# EAGLE design gamifyPCB (EAGLE 9.4.1)
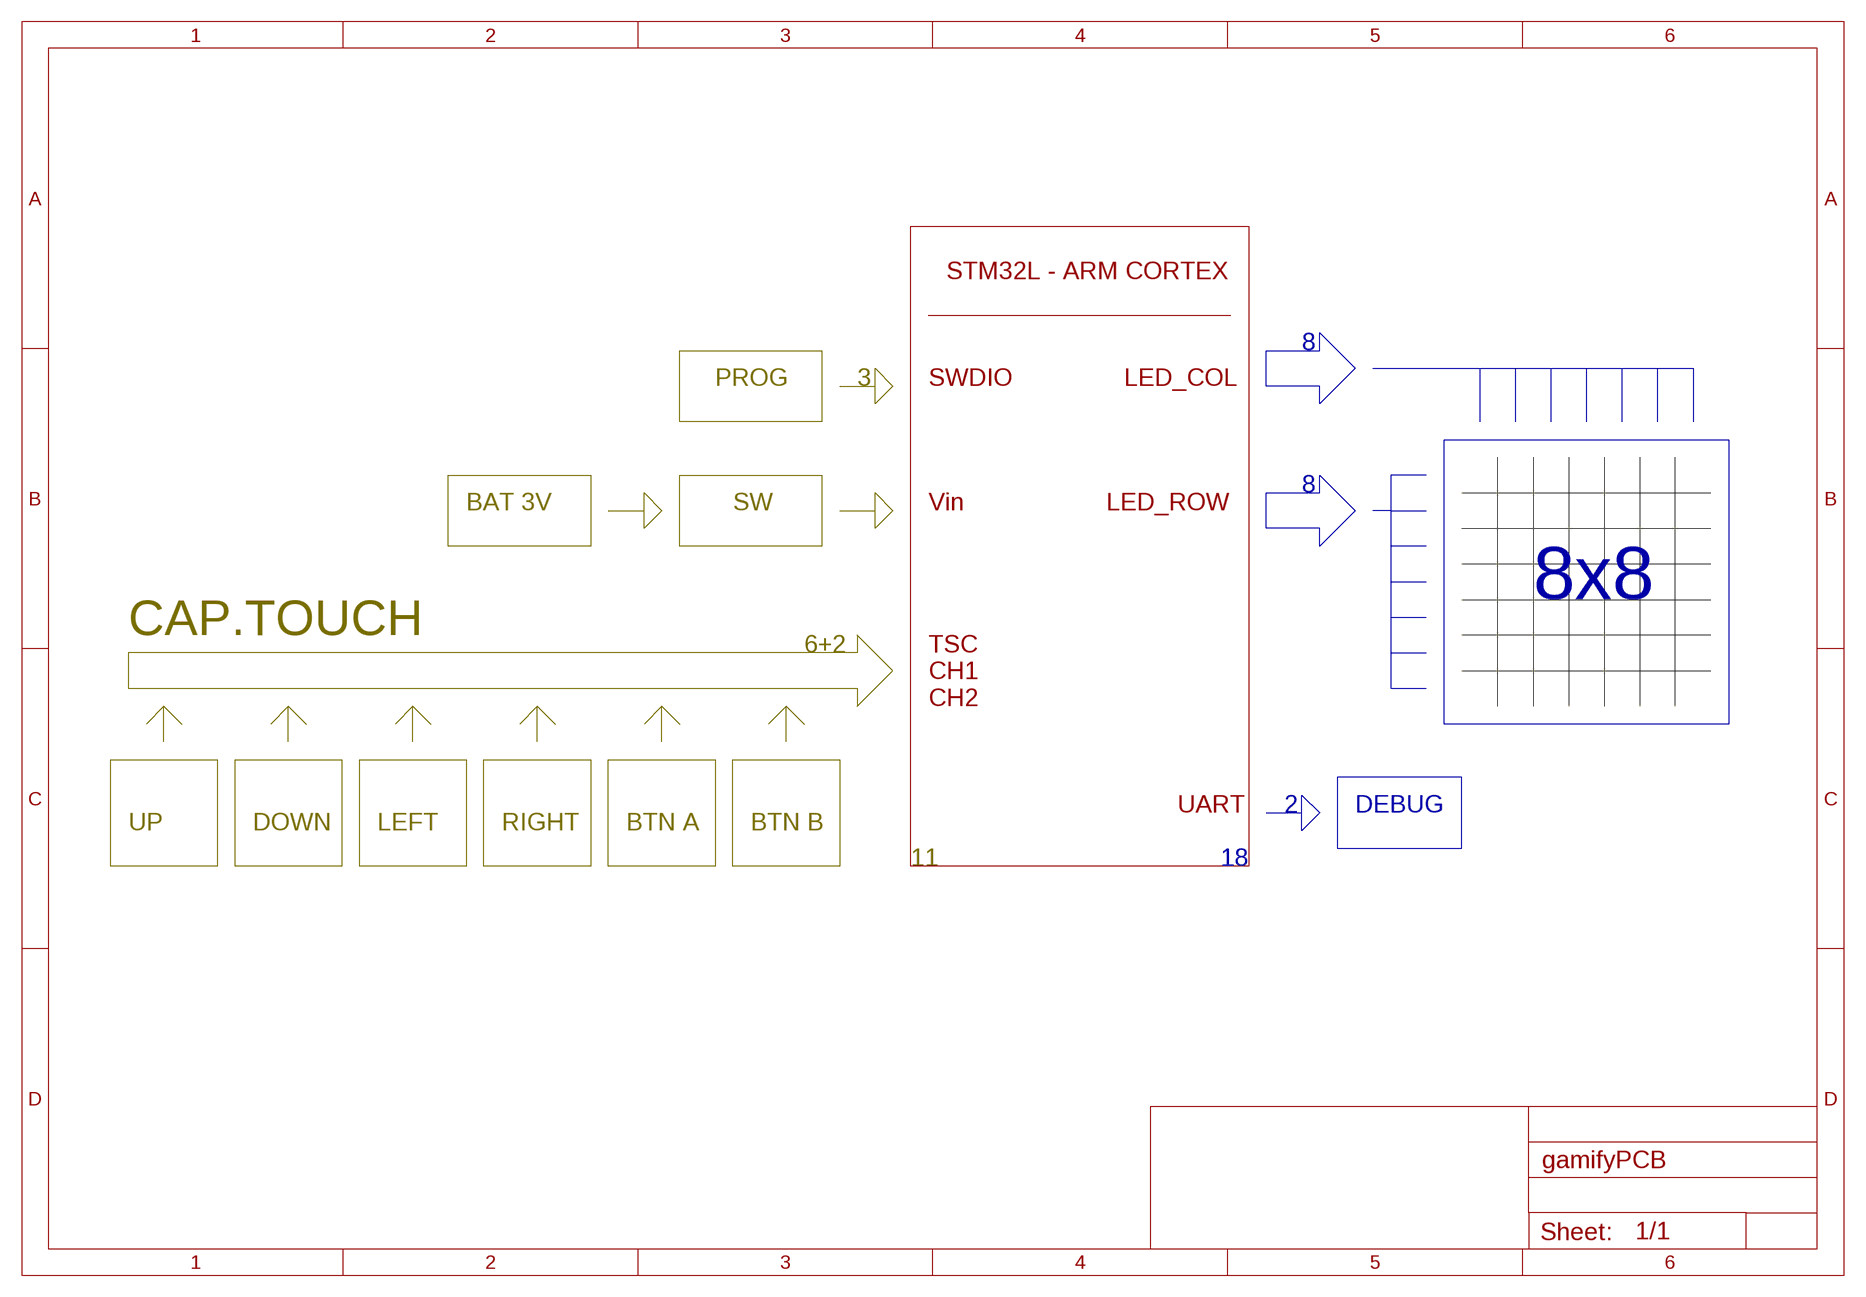
[diagram p0: schematic, sheet 1, part 1 of 2]
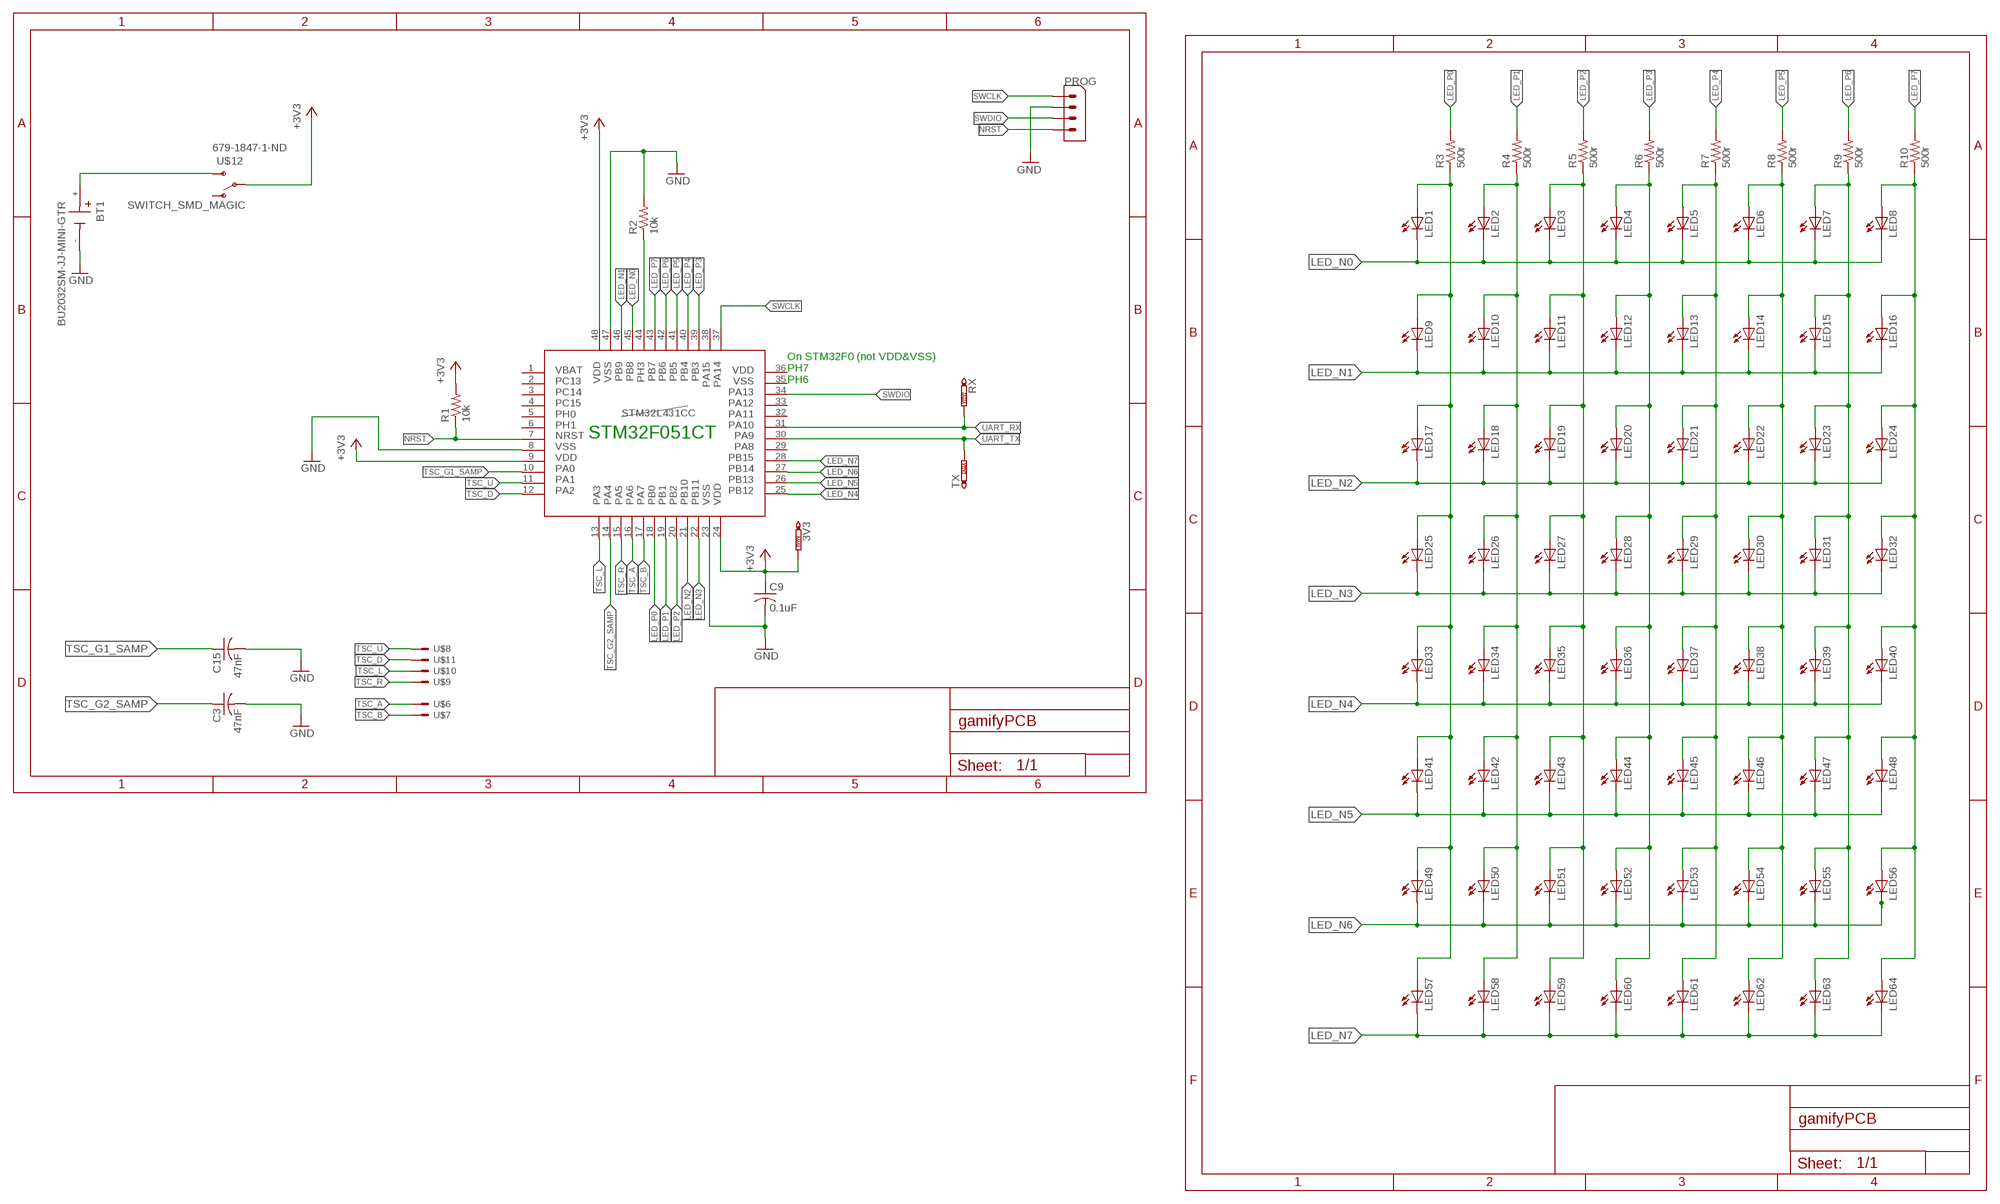
[diagram p1: schematic, sheet 1, part 2 of 2]

## Parts
3V3  PTR1B1,27  [B1,27]
BT1  BU2032SM-JJ-MINI-GTR  [BAT_BU2032SM-JJ-MINI-GTR]
C3  47nF  C-USC0603  [C0603]
C9  0.1uF  C-USC0603  [C0603]
C15  47nF  C-USC0603  [C0603]
LED1  LEDCHIP-LED0603  [CHIP-LED0603]
LED2  LEDCHIP-LED0603  [CHIP-LED0603]
LED3  LEDCHIP-LED0603  [CHIP-LED0603]
LED4  LEDCHIP-LED0603  [CHIP-LED0603]
LED5  LEDCHIP-LED0603  [CHIP-LED0603]
LED6  LEDCHIP-LED0603  [CHIP-LED0603]
LED7  LEDCHIP-LED0603  [CHIP-LED0603]
LED8  LEDCHIP-LED0603  [CHIP-LED0603]
LED9  LEDCHIP-LED0603  [CHIP-LED0603]
LED10  LEDCHIP-LED0603  [CHIP-LED0603]
LED11  LEDCHIP-LED0603  [CHIP-LED0603]
LED12  LEDCHIP-LED0603  [CHIP-LED0603]
LED13  LEDCHIP-LED0603  [CHIP-LED0603]
LED14  LEDCHIP-LED0603  [CHIP-LED0603]
LED15  LEDCHIP-LED0603  [CHIP-LED0603]
LED16  LEDCHIP-LED0603  [CHIP-LED0603]
LED17  LEDCHIP-LED0603  [CHIP-LED0603]
LED18  LEDCHIP-LED0603  [CHIP-LED0603]
LED19  LEDCHIP-LED0603  [CHIP-LED0603]
LED20  LEDCHIP-LED0603  [CHIP-LED0603]
LED21  LEDCHIP-LED0603  [CHIP-LED0603]
LED22  LEDCHIP-LED0603  [CHIP-LED0603]
LED23  LEDCHIP-LED0603  [CHIP-LED0603]
LED24  LEDCHIP-LED0603  [CHIP-LED0603]
LED25  LEDCHIP-LED0603  [CHIP-LED0603]
LED26  LEDCHIP-LED0603  [CHIP-LED0603]
LED27  LEDCHIP-LED0603  [CHIP-LED0603]
LED28  LEDCHIP-LED0603  [CHIP-LED0603]
LED29  LEDCHIP-LED0603  [CHIP-LED0603]
LED30  LEDCHIP-LED0603  [CHIP-LED0603]
LED31  LEDCHIP-LED0603  [CHIP-LED0603]
LED32  LEDCHIP-LED0603  [CHIP-LED0603]
LED33  LEDCHIP-LED0603  [CHIP-LED0603]
LED34  LEDCHIP-LED0603  [CHIP-LED0603]
LED35  LEDCHIP-LED0603  [CHIP-LED0603]
LED36  LEDCHIP-LED0603  [CHIP-LED0603]
LED37  LEDCHIP-LED0603  [CHIP-LED0603]
LED38  LEDCHIP-LED0603  [CHIP-LED0603]
LED39  LEDCHIP-LED0603  [CHIP-LED0603]
LED40  LEDCHIP-LED0603  [CHIP-LED0603]
LED41  LEDCHIP-LED0603  [CHIP-LED0603]
LED42  LEDCHIP-LED0603  [CHIP-LED0603]
LED43  LEDCHIP-LED0603  [CHIP-LED0603]
LED44  LEDCHIP-LED0603  [CHIP-LED0603]
LED45  LEDCHIP-LED0603  [CHIP-LED0603]
LED46  LEDCHIP-LED0603  [CHIP-LED0603]
LED47  LEDCHIP-LED0603  [CHIP-LED0603]
LED48  LEDCHIP-LED0603  [CHIP-LED0603]
LED49  LEDCHIP-LED0603  [CHIP-LED0603]
LED50  LEDCHIP-LED0603  [CHIP-LED0603]
LED51  LEDCHIP-LED0603  [CHIP-LED0603]
LED52  LEDCHIP-LED0603  [CHIP-LED0603]
LED53  LEDCHIP-LED0603  [CHIP-LED0603]
LED54  LEDCHIP-LED0603  [CHIP-LED0603]
LED55  LEDCHIP-LED0603  [CHIP-LED0603]
LED56  LEDCHIP-LED0603  [CHIP-LED0603]
LED57  LEDCHIP-LED0603  [CHIP-LED0603]
LED58  LEDCHIP-LED0603  [CHIP-LED0603]
LED59  LEDCHIP-LED0603  [CHIP-LED0603]
LED60  LEDCHIP-LED0603  [CHIP-LED0603]
LED61  LEDCHIP-LED0603  [CHIP-LED0603]
LED62  LEDCHIP-LED0603  [CHIP-LED0603]
LED63  LEDCHIP-LED0603  [CHIP-LED0603]
LED64  LEDCHIP-LED0603  [CHIP-LED0603]
PROG  4-PIN-1.25MM  [4-PIN-1.25MM]
R1  10k  R-US_R0603  [R0603]
R2  10k  R-US_R0603  [R0603]
R3  500r  R-US_R0603  [R0603]
R4  500r  R-US_R0603  [R0603]
R5  500r  R-US_R0603  [R0603]
R6  500r  R-US_R0603  [R0603]
R7  500r  R-US_R0603  [R0603]
R8  500r  R-US_R0603  [R0603]
R9  500r  R-US_R0603  [R0603]
R10  500r  R-US_R0603  [R0603]
RX  PTR1B1,27  [B1,27]
TX  PTR1B1,27  [B1,27]
U$2  STM32L431CC  [QFP50P900X900X160-48]
U$6  CAP_BUTTON  [CAPBUTTON]
U$7  CAP_BUTTON  [CAPBUTTON]
U$8  CAP_DPAD  [DPAD]
U$9  CAP_DPAD  [DPAD]
U$10  CAP_DPAD  [DPAD]
U$11  CAP_DPAD  [DPAD]
U$12  SWITCH_SMD_MAGIC  [SWITCH_SMD_SUNKEN]

## Nets
+3V3: 3V3.TP C9.1 R1.2 U$2.9 U$2.24 U$2.48 U$12.2(P)
GND: BT1.- C3.2 C9.2 C15.2 PROG.P$3 R2.2 U$2.8 U$2.23 U$2.47
LED_N0: LED1.C LED2.C LED3.C LED4.C LED5.C LED6.C LED7.C LED8.C U$2.45
LED_N1: LED9.C LED10.C LED11.C LED12.C LED13.C LED14.C LED15.C LED16.C U$2.46
LED_N2: LED17.C LED18.C LED19.C LED20.C LED21.C LED22.C LED23.C LED24.C U$2.21
LED_N3: LED25.C LED26.C LED27.C LED28.C LED29.C LED30.C LED31.C LED32.C U$2.22
LED_N4: LED33.C LED34.C LED35.C LED36.C LED37.C LED38.C LED39.C LED40.C U$2.25
LED_N5: LED41.C LED42.C LED43.C LED44.C LED45.C LED46.C LED47.C LED48.C U$2.26
LED_N6: LED49.C LED50.C LED51.C LED52.C LED53.C LED54.C LED55.C LED56.C U$2.27
LED_N7: LED57.C LED58.C LED59.C LED60.C LED61.C LED62.C LED63.C LED64.C U$2.28
LED_P0: R3.2 U$2.18
LED_P0B: LED1.A LED9.A LED17.A LED25.A LED33.A LED41.A LED49.A LED57.A R3.1
LED_P1: R4.2 U$2.19
LED_P1B: LED2.A LED10.A LED18.A LED26.A LED34.A LED42.A LED50.A LED58.A R4.1
LED_P2: R5.2 U$2.20
LED_P2B: LED3.A LED11.A LED19.A LED27.A LED35.A LED43.A LED51.A LED59.A R5.1
LED_P3: R6.2 U$2.39
LED_P3B: LED4.A LED12.A LED20.A LED28.A LED36.A LED44.A LED52.A LED60.A R6.1
LED_P4: R7.2 U$2.40
LED_P4B: LED5.A LED13.A LED21.A LED29.A LED37.A LED45.A LED53.A LED61.A R7.1
LED_P5: R8.2 U$2.41
LED_P5B: LED6.A LED14.A LED22.A LED30.A LED38.A LED46.A LED54.A LED62.A R8.1
LED_P6: R9.2 U$2.42
LED_P6B: LED7.A LED15.A LED23.A LED31.A LED39.A LED47.A LED55.A LED63.A R9.1
LED_P7: R10.2 U$2.43
LED_P7B: LED8.A LED16.A LED24.A LED32.A LED40.A LED48.A LED56.A LED64.A R10.1
N$6: R2.1 U$2.44
N$14: BT1.+ U$12.3(S)
NRST: PROG.P$1 R1.1 U$2.7
SWCLK: PROG.P$4 U$2.37
SWDIO: PROG.P$2 U$2.34
TSC_A: U$2.16 U$6.P$1(S) U$6.P$2(S)
TSC_B: U$2.17 U$7.P$1(S) U$7.P$2(S)
TSC_D: U$2.12 U$11.P$1(S)
TSC_G1_SAMP: C15.1 U$2.10
TSC_G2_SAMP: C3.1 U$2.14
TSC_L: U$2.13 U$10.P$1(S)
TSC_R: U$2.15 U$9.P$1(S)
TSC_U: U$2.11 U$8.P$1(S)
UART_RX: RX.TP U$2.31
UART_TX: TX.TP U$2.30
Unconnected: U$2.1 U$2.2 U$2.3 U$2.4 U$2.5 U$2.6 U$2.29 U$2.32 U$2.33 U$2.35 U$2.36 U$2.38 U$12.1(O)

## Buses
B$1
B$2
B$3
B$4
B$5
B$7
B$6
B$8

## Notes on the sheet
- 679-1847-1-ND
- STM32L - ARM CORTEX
- 8
- PROG | 3 | SWDIO | LED_COL
- 8
- BAT 3V | SW | Vin | LED_ROW
- 8x8
- On STM32F0 (not VDD&VSS)
  PH7
  PH6
- CAP.TOUCH
- 6+2
- TSC 
  CH1
  CH2
- STM32F051CT
- UART | 2 | DEBUG
- UP | DOWN | LEFT | RIGHT | BTN A | BTN B
- 11 | 18

## Library data of the parts
3V3 RX TX = testpad:PTR1: TEST PIN
BT1 = BU2032SM-JJ-MINI-GTR:BU2032SM-JJ-MINI-GTR; AVAILABILITY: Unavailable; DESCRIPTION: Battery Holder _Open_ Coin, 20.0mm 1 Cell SMD _SMT_ Tab; MF: MPD _Memory; MP: BU2032SM-JJ-MINI-GTR; PACKAGE: None; PRICE: None
C3 C9 C15 = rcl:C-US: CAPACITOR, American symbol; SPICEPREFIX: C
LED1-LED64 = adafruit:LED: LED OSRAM: - CHIPLED LG R971, LG N971, LY N971, LG Q971, LY Q971, LO R971, LY R971 LH N974, LH R974 LS Q976, LO Q976, LY Q976 LO Q996 - Hyper CHIPLED LW Q18S LB Q993, LB Q99A, LB R99A - SideLED LS A670, LO A670, LY A670, LG A670, LP A670 LB A673, LV A673, LT A673, LW A673 LH A674 LY A675 LS A676, LA A676, LO A676, LY A676, LW A676 LS A679, LY A679, LG A679 - Hyper Micro SIDELED® LS Y876, LA Y876, LO Y876, LY Y876 LT Y87S - SmartLED LW L88C, LW L88S LB L89C, LB L89S, LG L890 LS L89K, LO L89K, LY L89K LS L896, LA L896, LO L896, LY L896 - TOPLED LS T670, LO T670, LY T670, LG T670, LP T670 LSG T670, LSP T670, LSY T670, LOP T670, LYG T670 LG T671, LOG T671, LSG T671 LB T673, LV T673, LT T673, LW T673 LH T674 LS T676, LA T676, LO T676, LY T676, LB T676, LH T676, LSB T676, LW T676 LB T67C, LV T67C, LT T67C, LS T67K, LO T67K, LY T67K, LW E67C LS E67B, LA E67B, LO E67B, LY E67B, LB E67C, LV E67C, LT E67C LW T67C LS T679, LY T679, LG T679 LS T770, LO T770, LY T770, LG T770, LP T770 LB T773, LV T773, LT T773, LW T773 LH T774 LS E675, LA E675, LY E675, LS T675 LS T776, LA T776, LO T776, LY T776, LB T776 LHGB T686 LT T68C, LB T68C - Hyper Mini TOPLED® LB M676 - Mini TOPLED Santana® LG M470 LS M47K, LO M47K, LY M47K Source: http://www.osram.convergy.de/
PROG = Wingling Library:4-PIN-1.25MM
R1-R10 = rcl:R-US_: RESISTOR, American symbol; SPICEPREFIX: R
U$2 = prankbox:STM32L431CC
U$6 U$7 = !klib:CAP_BUTTON
U$8-U$11 = !klib:CAP_DPAD
U$12 = !klib:SWITCH_SMD_MAGIC

## Board
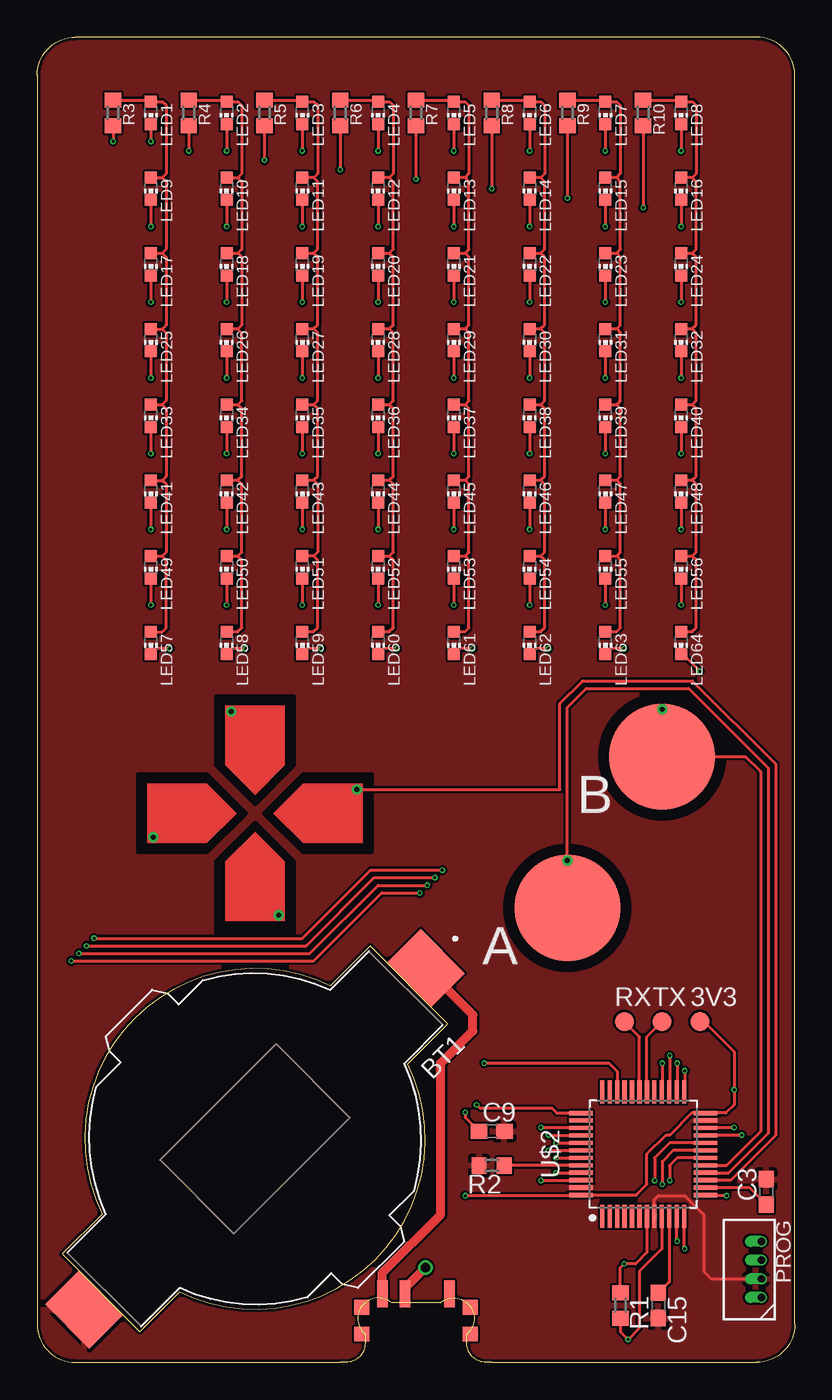
[diagram p2: board, top side]
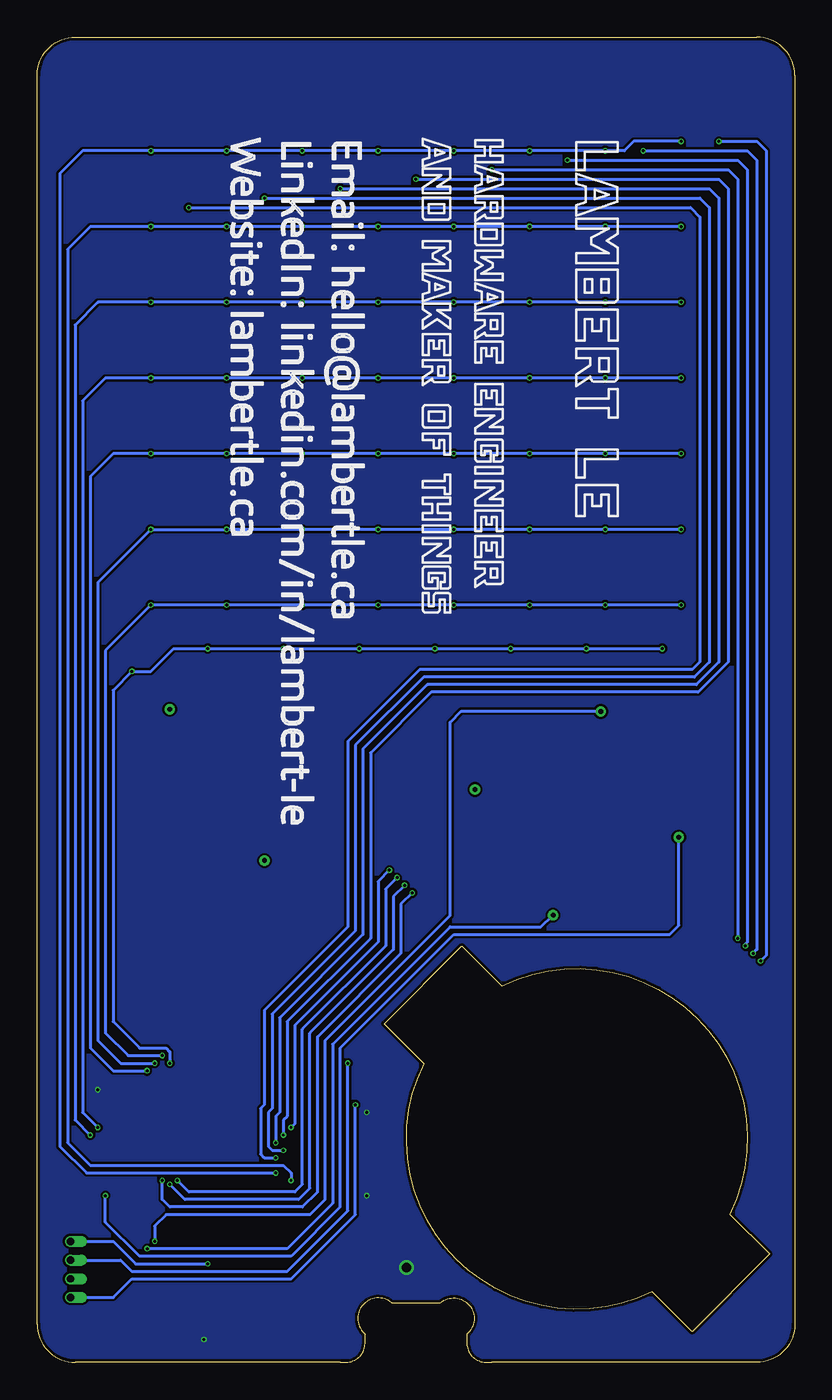
[diagram p3: board, bottom side, seen from below]

Size 50.8 x 88.9 mm. Coordinates in mm from the lower left corner, seen from the top.
Outline: 20.32,0 2.54,0 arc-90 0,2.54 0,86.36 arc-90 2.54,88.9 48.26,88.9 arc-90 50.8,86.36 50.8,2.54 arc-90 48.26,0 30.48,0
Copper layers (1*16): Top 0.035mm / dielectric 0.2mm / Bottom 0.035mm
Design rules "JLC_2Layer_(workInProgress)": minimum track width 3.5mil, minimum drill 0.2mm, track to track 3.5mil, track to pad 5mil, pad to pad 5mil, via to via 5mil, smd to smd 0mil, copper to edge 0.2mm, drill to drill 0.2mm, minimum pad ring 3mil, minimum via ring 3mil, stop-mask expansion 0mil, vias tented up to drill 100mil, thermal gap 10mil

### Footprints (pad centres in the part's own frame; a part is rotated, then mirrored left to right if it is on the bottom)
B1,27 = smd 1.27 x 1.27: TP 0,0
BAT_BU2032SM-JJ-MINI-GTR = smd 3.2 x 4.2: + -16.205,0; - 16.205,0
C0603 = smd 1.1 x 1: 1 -0.85,0; 2 0.85,0
CHIP-LED0603 = smd 0.8 x 0.8: A 0,-0.75; C 0,0.75
4-PIN-1.25MM = drill 0.5 offset: P$1 -1.875,0.82; P$2 -0.625,0.82; P$3 0.625,0.82; P$4 1.875,0.82
R0603 = smd 1 x 1.1: 1 -0.85,0; 2 0.85,0
QFP50P900X900X160-48 = smd 1.559 x 0.28: 1 -4.178,2.75; 2 -4.178,2.25; 3 -4.178,1.75; 4 -4.178,1.25; 5 -4.178,0.75; 6 -4.178,0.25; 7 -4.178,-0.25; 8 -4.178,-0.75; 9 -4.178,-1.25; 10 -4.178,-1.75; 11 -4.178,-2.25; 12 -4.178,-2.75; 25 4.178,-2.75; 26 4.178,-2.25; 27 4.178,-1.75; 28 4.178,-1.25; 29 4.178,-0.75; 30 4.178,-0.25; 31 4.178,0.25; 32 4.178,0.75; 33 4.178,1.25; 34 4.178,1.75; 35 4.178,2.25; 36 4.178,2.75 | smd 0.28 x 1.559: 13 -2.75,-4.178; 14 -2.25,-4.178; 15 -1.75,-4.178; 16 -1.25,-4.178; 17 -0.75,-4.178; 18 -0.25,-4.178; 19 0.25,-4.178; 20 0.75,-4.178; 21 1.25,-4.178; 22 1.75,-4.178; 23 2.25,-4.178; 24 2.75,-4.178; 37 2.75,4.178; 38 2.25,4.178; 39 1.75,4.178; 40 1.25,4.178; 41 0.75,4.178; 42 0.25,4.178; 43 -0.25,4.178; 44 -0.75,4.178; 45 -1.25,4.178; 46 -1.75,4.178; 47 -2.25,4.178; 48 -2.75,4.178
CAPBUTTON = smd 7.112 x 7.112: P$1 0,0 | drill 0.33 pad 0.686: P$2 0,3.175
DPAD = drill 0.33 pad 0.686: P$1 -6.2,-1.6
SWITCH_SMD_SUNKEN = smd 0.7 x 1.8: 1 -2.25,-4.592; 2 0.75,-4.592; 3 2.25,-4.592 | smd 1 x 1: GND1 -3.65,-1.892; GND2 -3.65,-3.692; GND3 3.65,-1.892; GND4 3.65,-3.692

### Placement (x,y rotation side)
3V3  44.45,22.86 0 top
BT1  14.61,14.99 225 top
C3  48.9,11.43 90 top
C9  30.48,15.49 0 top
C15  41.66,3.81 270 top
LED1  7.62,83.82 180 top
LED2  12.7,83.82 180 top
LED3  17.78,83.82 180 top
LED4  22.86,83.82 180 top
LED5  27.94,83.82 180 top
LED6  33.02,83.82 180 top
LED7  38.1,83.82 180 top
LED8  43.18,83.82 180 top
LED9  7.62,78.74 180 top
LED10  12.7,78.74 180 top
LED11  17.78,78.74 180 top
LED12  22.86,78.74 180 top
LED13  27.94,78.74 180 top
LED14  33.02,78.74 180 top
LED15  38.1,78.74 180 top
LED16  43.18,78.74 180 top
LED17  7.62,73.66 180 top
LED18  12.7,73.66 180 top
LED19  17.78,73.66 180 top
LED20  22.86,73.66 180 top
LED21  27.94,73.66 180 top
LED22  33.02,73.66 180 top
LED23  38.1,73.66 180 top
LED24  43.18,73.66 180 top
LED25  7.62,68.58 180 top
LED26  12.7,68.58 180 top
LED27  17.78,68.58 180 top
LED28  22.86,68.58 180 top
LED29  27.94,68.58 180 top
LED30  33.02,68.58 180 top
LED31  38.1,68.58 180 top
LED32  43.18,68.58 180 top
LED33  7.62,63.5 180 top
LED34  12.7,63.5 180 top
LED35  17.78,63.5 180 top
LED36  22.86,63.5 180 top
LED37  27.94,63.5 180 top
LED38  33.02,63.5 180 top
LED39  38.1,63.5 180 top
LED40  43.18,63.5 180 top
LED41  7.62,58.42 180 top
LED42  12.7,58.42 180 top
LED43  17.78,58.42 180 top
LED44  22.86,58.42 180 top
LED45  27.94,58.42 180 top
LED46  33.02,58.42 180 top
LED47  38.1,58.42 180 top
LED48  43.18,58.42 180 top
LED49  7.62,53.34 180 top
LED50  12.7,53.34 180 top
LED51  17.78,53.34 180 top
LED52  22.86,53.34 180 top
LED53  27.94,53.34 180 top
LED54  33.02,53.34 180 top
LED55  38.1,53.34 180 top
LED56  43.18,53.34 180 top
LED57  7.62,48.26 180 top
LED58  12.7,48.26 180 top
LED59  17.78,48.26 180 top
LED60  22.86,48.26 180 top
LED61  27.94,48.26 180 top
LED62  33.02,48.26 180 top
LED63  38.1,48.26 180 top
LED64  43.18,48.26 180 top
PROG  47.75,6.22 270 top
R1  39.12,3.81 270 top
R2  30.48,13.21 180 top
R3  5.08,83.82 270 top
R4  10.16,83.82 270 top
R5  15.24,83.82 270 top
R6  20.32,83.82 270 top
R7  25.4,83.82 270 top
R8  30.48,83.82 270 top
R9  35.56,83.82 270 top
R10  40.64,83.82 270 top
RX  39.37,22.86 0 top
TX  41.91,22.86 0 top
U$2  40.64,13.97 90 top
U$6  35.56,30.48 0 top
U$7  41.91,40.64 0 top
U$8  14.61,37.47 270 top
U$9  15.24,36.83 180 top
U$10  13.97,36.83 0 top
U$11  14.61,36.2 90 top
U$12  25.4,0 180 top

### Tracks (layer width: path | path; a pad name or v marks a point on that pad's centre or on a via)
+3V3  (via drill 0.2, 0.65)
  Top 0.203: C9.1 28.7,16.42 v28.7,16.76 | R1.2 39.12,2.03 v39.62,1.52 40.39,2.29 40.39,6.1 41.89,7.6 U$2.9 | v28.7,11.18 36.42,11.18 U$2.48 40.18,11.22 40.89,11.94 40.89,13.97 42.16,15.24 42.42,15.24 43.9,16.72 U$2.24 46.18,16.72 46.74,17.27 v46.74,18.29 46.74,20.83 44.7,22.86 3V3.TP
  Top 0.61: U$12.2 24.65,4.96 v26.04,6.35
  pour Bottom (isolate 0.152): -5.08,-7.62 53.34,-7.62 53.34,93.98 -5.08,93.98
GND
  Top 0.203: U$2.8 41.39,10.91 41.66,11.18 43.43,11.18 44.7,9.91 44.7,6.1 45.21,5.59 48.56,5.59 PROG.P$3
  pour Top (isolate 0.152): -2.54,91.44 55.88,91.44 55.88,-5.08 -2.54,-5.08
LED_N0  (via drill 0.2)
  Top 0.203: LED1.C v7.62,81.92 | LED2.C v12.7,81.28 | LED3.C v17.78,81.28 | LED4.C v22.86,81.28 | LED5.C v27.94,81.28 | LED6.C v33.02,81.28 | LED7.C v38.1,81.28 | LED8.C v43.18,81.28 | v34.8,12.7 34.82,12.72 U$2.45
  Bottom 0.203: v7.62,81.92 10.79,81.92 11.43,81.28 v12.7,81.28 v17.78,81.28 v22.86,81.28 v27.94,81.28 v33.02,81.28 v38.1,81.28 v43.18,81.28 47.75,81.28 49.28,79.76 49.28,14.48 47.5,12.7 v34.8,12.7
LED_N1  (via drill 0.2)
  Top 0.203: LED9.C v7.62,76.2 | LED10.C v12.7,76.2 | LED11.C v17.78,76.2 | LED12.C v22.86,76.2 | LED13.C v27.94,76.2 | LED14.C v33.02,76.2 | LED15.C v38.1,76.2 | LED16.C v43.18,76.2 | v33.78,12.19 36.43,12.19 U$2.46
  Bottom 0.203: v7.62,76.2 v12.7,76.2 v17.78,76.2 v22.86,76.2 v27.94,76.2 v33.02,76.2 v38.1,76.2 v43.18,76.2 47.24,76.2 48.77,74.68 48.77,14.73 47.24,13.21 34.29,13.21 33.78,12.7 v33.78,12.19
LED_N2  (via drill 0.2)
  Top 0.203: LED17.C v7.62,71.12 | LED18.C v12.7,71.12 | LED19.C v17.78,71.12 | LED20.C v22.86,71.12 | LED21.C v27.94,71.12 | LED22.C v33.02,71.12 | LED23.C v38.1,71.12 | LED24.C v43.18,71.12 | v47.24,15.24 47.22,15.22 U$2.21
  Bottom 0.203: v7.62,71.12 v12.7,71.12 v17.78,71.12 v22.86,71.12 v27.94,71.12 v33.02,71.12 v38.1,71.12 v43.18,71.12 46.74,71.12 48.26,69.6 48.26,16.26 v47.24,15.24
LED_N3  (via drill 0.2)
  Top 0.203: LED25.C v7.62,66.04 | LED26.C v12.7,66.04 | LED27.C v17.78,66.04 | LED28.C v22.86,66.04 | LED29.C v27.94,66.04 | LED31.C v38.1,66.04 | LED32.C v43.18,66.04 | LED30.C v33.02,66.04 | v46.74,15.75 46.71,15.72 U$2.22
  Bottom 0.203: v7.62,66.04 v12.7,66.04 v17.78,66.04 v22.86,66.04 v27.94,66.04 v33.02,66.04 v38.1,66.04 v43.18,66.04 46.23,66.04 47.75,64.52 47.75,16.76 v46.74,15.75
LED_N4  (via drill 0.2)
  Top 0.203: LED33.C v7.62,60.96 | LED34.C v12.7,60.96 | LED35.C v17.78,60.96 | LED36.C v22.86,60.96 | LED37.C v27.94,60.96 | LED38.C v33.02,60.96 | LED39.C v38.1,60.96 | LED40.C v43.18,60.96 | v43.43,19.56 43.43,18.19 U$2.25
  Bottom 0.203: v7.62,60.96 v12.7,60.96 v17.78,60.96 v22.86,60.96 v27.94,60.96 v33.02,60.96 v38.1,60.96 v43.18,60.96 45.72,60.96 47.24,59.44 47.24,21.08 45.72,19.56 v43.43,19.56
LED_N5  (via drill 0.2)
  Top 0.203: LED41.C v7.62,55.88 | LED42.C v12.7,55.88 | LED43.C v17.78,55.88 | LED44.C v22.86,55.88 | LED45.C v27.94,55.88 | LED46.C v33.02,55.88 | LED47.C v38.1,55.88 | LED48.C v43.18,55.88 | v42.93,20.07 42.93,18.18 U$2.26
  Bottom 0.203: v7.62,55.88 v12.7,55.88 v17.78,55.88 v22.86,55.88 v27.94,55.88 v33.02,55.88 v38.1,55.88 v43.18,55.88 46.74,52.32 46.74,21.59 45.21,20.07 v42.93,20.07
LED_N6  (via drill 0.2)
  Top 0.203: LED49.C v7.62,50.8 | LED50.C v12.7,50.8 | LED51.C v17.78,50.8 | LED52.C v22.86,50.8 | LED53.C v27.94,50.8 | LED54.C v33.02,50.8 | LED55.C v38.1,50.8 | LED56.C v43.18,50.8 | v42.42,20.57 42.42,18.18 U$2.27
  Bottom 0.203: v7.62,50.8 v12.7,50.8 v17.78,50.8 v22.86,50.8 v27.94,50.8 v33.02,50.8 v38.1,50.8 v43.18,50.8 46.23,47.75 46.23,22.1 44.7,20.57 v42.42,20.57
LED_N7  (via drill 0.2)
  Top 0.203: v8.89,47.88 7.99,47.88 LED57.C | v13.97,47.88 13.07,47.88 LED58.C | v19.05,47.88 18.15,47.88 LED59.C | v24.13,47.88 23.23,47.88 LED60.C | LED61.C 28.31,47.88 v29.21,47.88 | LED62.C 33.39,47.88 v34.29,47.88 | v39.37,47.88 38.47,47.88 LED63.C | U$2.28 41.91,18.17 v41.91,20.07 | LED64.C 43.3,47.51 v44.45,46.35
  Bottom 0.203: v8.89,47.88 v13.97,47.88 v19.05,47.88 v24.13,47.88 v29.21,47.88 v34.29,47.88 v39.37,47.88 41.66,47.88 43.18,46.35 v44.45,46.35 45.72,45.09 45.72,22.86 43.94,21.08 42.16,21.08 41.91,20.83 v41.91,20.07
LED_P0  (via drill 0.2)
  Top 0.203: R3.2 v5.08,81.92 | U$2.18 42.93,13.72 42.42,13.21 v42.42,12.19 | v2.29,26.92 18.54,26.92 23.11,31.5 v25.65,31.5
  Bottom 0.203: v5.08,81.92 2.54,81.92 1.91,81.28 1.91,27.3 v2.29,26.92 | v42.42,12.19 42.42,10.92 41.91,10.41 33.02,10.41 32,11.43 32,21.84 26.42,27.43 26.42,30.73 v25.65,31.5
LED_P0B
  Top 0.203: R3.1 7.52,84.67 LED1.A 8.39,84.57 8.64,84.33 8.64,79.76 8.37,79.49 | LED9.A 8.37,79.49 | 8.37,79.49 8.64,79.22 8.64,74.68 8.37,74.41 | LED17.A 8.37,74.41 | 8.37,74.41 8.64,74.14 8.64,69.6 8.37,69.33 | LED25.A 8.37,69.33 | 8.37,69.33 8.64,69.06 8.64,64.52 8.37,64.25 | LED33.A 8.37,64.25 | 8.37,64.25 8.64,63.98 8.64,59.44 8.37,59.17 | LED41.A 8.37,59.17 | 8.37,59.17 8.64,58.9 8.64,54.36 8.37,54.09 | LED49.A 8.37,54.09 | 8.37,54.09 8.64,53.82 8.64,49.28 8.37,49.01 LED57.A
LED_P1  (via drill 0.2)
  Top 0.203: R4.2 v10.16,81.28 | U$2.19 42.67,14.22 41.91,13.46 v41.91,11.94 | v2.79,27.43 18.29,27.43 22.86,32 v26.16,32
  Bottom 0.203: v10.16,81.28 3.17,81.28 2.54,80.64 2.54,27.69 v2.79,27.43 | v41.91,11.94 40.89,10.92 33.27,10.92 32.51,11.68 32.51,22.1 26.92,27.69 26.92,31.24 v26.16,32
LED_P1B
  Top 0.203: R4.1 12.6,84.67 LED2.A 13.47,84.57 13.72,84.33 13.72,79.76 13.45,79.49 | LED10.A 13.45,79.49 | 13.45,79.49 13.72,79.22 13.72,74.68 13.45,74.41 | LED18.A 13.45,74.41 | 13.45,74.41 13.47,74.41 13.72,74.17 13.72,69.6 13.45,69.33 | 13.45,69.33 LED26.A | LED34.A 12.71,64.26 13.46,64.26 | 13.46,64.26 13.72,64.52 13.72,69.06 13.45,69.33 | LED42.A 12.71,59.18 13.46,59.18 | 13.46,59.18 13.72,59.44 13.72,64.01 13.46,64.26 | LED50.A 12.71,54.1 13.46,54.1 | 13.46,54.1 13.72,54.36 13.72,58.93 13.46,59.18 | LED58.A 12.71,49.02 13.46,49.02 13.72,49.28 13.72,53.85 13.46,54.1
LED_P2  (via drill 0.2)
  Top 0.203: R5.2 v15.24,80.64 | U$2.20 42.41,14.72 41.4,13.72 v41.4,12.19 | v3.3,27.94 18.03,27.94 22.61,32.51 v26.67,32.51
  Bottom 0.203: v15.24,80.64 3.81,80.64 3.17,80.01 3.17,28.19 3.3,28.07 v3.3,27.94 | v41.4,12.19 40.64,11.43 33.53,11.43 33.02,11.94 33.02,22.35 27.43,27.94 27.43,31.75 v26.67,32.51
LED_P2B
  Top 0.203: R5.1 17.68,84.67 LED3.A 18.55,84.57 18.8,84.33 18.8,79.76 18.53,79.49 | 18.53,79.49 LED11.A | LED19.A 17.79,74.42 18.54,74.42 | 18.54,74.42 18.8,74.68 18.8,79.22 18.53,79.49 | LED27.A 17.79,69.34 18.54,69.34 | 18.54,69.34 18.8,69.6 18.8,74.17 18.54,74.42 | LED35.A 17.79,64.26 18.54,64.26 | 18.54,64.26 18.8,64.52 18.8,69.09 18.54,69.34 | 18.54,64.26 18.8,64.01 18.8,59.44 18.54,59.18 | LED51.A 18.54,54.1 | LED43.A 17.79,59.18 18.54,59.18 | 18.54,59.18 18.8,58.93 18.8,54.36 18.54,54.1 | LED59.A 17.79,49.02 18.54,49.02 18.8,49.28 18.8,53.84 18.54,54.1
LED_P3  (via drill 0.2)
  Top 0.203: R6.2 v20.32,80.01 | v33.78,15.75 36.43,15.75 U$2.39 | v3.81,28.45 17.78,28.45 22.35,33.02 v27.18,33.02
  Bottom 0.203: v20.32,80.01 4.45,80.01 3.81,79.38 v3.81,28.45 | v33.78,15.75 33.53,16 33.53,22.61 27.94,28.19 27.94,32.26 v27.18,33.02
LED_P3B
  Top 0.203: R6.1 22.76,84.67 LED4.A 23.63,84.57 23.88,84.33 23.88,79.76 23.61,79.49 | 23.61,79.49 LED12.A | LED20.A 22.87,74.42 23.62,74.42 | 23.62,74.42 23.88,74.68 23.88,79.22 23.61,79.49 | LED28.A 22.87,69.34 23.62,69.34 | 23.62,69.34 23.88,69.6 23.88,74.17 23.62,74.42 | LED36.A 22.87,64.26 23.62,64.26 | 23.62,64.26 23.88,64.52 23.88,69.09 23.62,69.34 | LED44.A 22.87,59.18 23.62,59.18 | 23.62,59.18 23.88,59.44 23.88,64.01 23.62,64.26 | LED52.A 22.87,54.1 23.62,54.1 | 23.62,54.1 23.88,54.36 23.88,58.93 23.62,59.18 | LED60.A 22.87,49.02 23.62,49.02 23.88,49.28 23.88,53.85 23.62,54.1
LED_P4  (via drill 0.2)
  Top 0.203: R7.2 v25.4,79.38 | v34.29,15.24 36.44,15.24 U$2.40
  Bottom 0.203: v25.4,79.38 5.08,79.38 4.45,78.74 4.45,46.99 6.48,44.96 24.38,44.96 28.45,40.89 28.45,28.45 34.04,22.86 34.04,16.51 34.29,16.26 v34.29,15.24
LED_P4B
  Top 0.203: R7.1 27.84,84.67 LED5.A 28.71,84.57 28.96,84.33 28.96,79.76 28.69,79.49 | 28.69,79.49 LED13.A | LED21.A 27.95,74.42 28.7,74.42 | 28.7,74.42 28.96,74.68 28.96,79.22 28.69,79.49 | LED29.A 27.95,69.34 28.7,69.34 | 28.7,69.34 28.96,69.6 28.96,74.17 28.7,74.42 | LED37.A 27.95,64.26 28.7,64.26 | 28.7,64.26 28.96,64.52 28.96,69.09 28.7,69.34 | LED45.A 27.95,59.18 28.7,59.18 | 28.7,59.18 28.96,59.44 28.96,64.01 28.7,64.26 | LED53.A 27.95,54.1 28.7,54.1 | 28.7,54.1 28.96,54.36 28.96,58.93 28.7,59.18 | 28.7,54.1 28.96,53.85 28.96,49.28 28.7,49.02 27.95,49.02 LED61.A
LED_P5  (via drill 0.2)
  Top 0.203: R8.2 v30.48,78.74 | v34.8,14.73 36.45,14.73 U$2.41
  Bottom 0.203: v30.48,78.74 5.71,78.74 5.08,78.11 5.08,46.97 6.59,45.47 24.64,45.47 28.96,41.15 28.96,28.7 34.54,23.11 34.54,16.76 34.8,16.51 v34.8,14.73
LED_P5B
  Top 0.203: R8.1 32.92,84.67 LED6.A 33.79,84.57 34.04,84.33 34.04,79.76 33.77,79.49 | 33.77,79.49 LED14.A | LED22.A 33.03,74.42 33.78,74.42 | 33.78,74.42 34.04,74.68 34.04,79.22 33.77,79.49 | LED30.A 33.03,69.34 33.78,69.34 | 33.78,69.34 34.04,69.6 34.04,74.17 33.78,74.42 | LED38.A 33.03,64.26 33.78,64.26 | 33.78,64.26 34.04,64.52 34.04,69.09 33.78,69.34 | LED46.A 33.03,59.18 33.78,59.18 | 33.78,59.18 34.04,59.44 34.04,64.01 33.78,64.26 | LED54.A 33.03,54.1 33.78,54.1 | 33.78,54.1 34.04,54.36 34.04,58.93 33.78,59.18 | LED62.A 33.03,49.02 33.78,49.02 34.04,49.28 34.04,53.85 33.78,54.1
LED_P6  (via drill 0.2)
  Top 0.203: R9.2 v35.56,78.11 | v34.29,14.22 U$2.42
  Bottom 0.203: v35.56,78.11 6.35,78.11 5.71,77.47 5.71,46.98 6.72,45.97 24.89,45.97 29.46,41.4 29.46,28.96 35.05,23.37 35.05,17.02 35.31,16.76 35.31,14.48 35.05,14.22 v34.29,14.22
LED_P6B
  Top 0.203: R9.1 38,84.67 LED7.A 38.87,84.57 39.12,84.33 39.12,79.76 38.85,79.49 | 38.85,79.49 LED15.A | LED23.A 38.11,74.42 38.86,74.42 | 38.86,74.42 39.12,74.68 39.12,79.22 38.85,79.49 | LED31.A 38.11,69.34 38.86,69.34 | 38.86,69.34 39.12,69.6 39.12,74.17 38.86,74.42 | LED39.A 38.11,64.26 38.86,64.26 | 38.86,64.26 39.12,64.52 39.12,69.09 38.86,69.34 | LED47.A 38.11,59.18 38.86,59.18 | 38.86,59.18 39.12,59.44 39.12,64.01 38.86,64.26 | LED55.A 38.11,54.1 38.86,54.1 | 38.86,54.1 39.12,54.36 39.12,58.93 38.86,59.18 | LED63.A 38.11,49.02 38.86,49.02 39.12,49.28 39.12,53.85 38.86,54.1
LED_P7  (via drill 0.2)
  Top 0.203: R10.2 v40.64,77.47 | v34.8,13.72 U$2.43
  Bottom 0.203: v40.64,77.47 6.99,77.47 6.35,76.83 6.35,46.99 6.86,46.48 25.15,46.48 29.97,41.66 29.97,29.21 35.56,23.62 35.56,17.27 35.81,17.02 35.81,13.97 35.56,13.72 v34.8,13.72
LED_P7B
  Top 0.203: R10.1 43.08,84.67 LED8.A 43.95,84.57 44.2,84.33 44.2,79.76 43.93,79.49 | 43.93,79.49 LED16.A | LED24.A 43.19,74.42 43.94,74.42 | 43.94,74.42 44.2,74.68 44.2,79.22 43.93,79.49 | LED32.A 43.19,69.34 43.94,69.34 | 43.94,69.34 44.2,69.6 44.2,74.17 43.94,74.42 | LED40.A 43.19,64.26 43.94,64.26 | 43.94,64.26 44.2,64.52 44.2,69.09 43.94,69.34 | LED48.A 43.19,59.18 43.94,59.18 | 43.94,59.18 44.2,59.44 44.2,64.01 43.94,64.26 | LED56.A 43.19,54.1 43.94,54.1 | 43.94,54.1 44.2,54.36 44.2,58.93 43.94,59.18 | LED64.A 43.19,49.02 43.94,49.02 44.2,49.28 44.2,53.85 43.94,54.1
N$6
  Top 0.203: U$2.44 31.34,13.22 R2.1
N$14
  Top 0.61: U$12.3 23.15,6 27.05,9.91 27.05,20.07 29.21,22.23 29.21,23.3 BT1.+
NRST  (via drill 0.2)
  Top 0.203: U$2.7 40.89,7.36 40.13,6.6 v39.37,6.6 39.11,6.35 39.12,6.35 R1.1
  Bottom 0.203: PROG.P$1 45.69,8.1 44.2,6.6 v39.37,6.6
SWCLK  (via drill 0.2)
  Top 0.203: v29.46,17.27 29.72,17.02 34.54,17.02 34.84,16.72 U$2.37
  Bottom 0.203: PROG.P$4 45.69,4.35 44.45,5.59 33.78,5.59 29.46,9.91 v29.46,17.27
SWDIO  (via drill 0.2)
  Top 0.203: U$2.34 38.89,19.53 38.35,20.07 v29.97,20.07
  Bottom 0.203: PROG.P$2 45.2,6.85 44.45,6.1 34.04,6.1 29.97,10.16 v29.97,20.07
TSC_A
  Top 0.203: U$2.16 46.38,12.72 49.05,15.39 49.05,39.85 43.69,45.21 36.83,45.21 35.56,43.94 U$6.P$1 U$6.P$2
TSC_B
  Top 0.203: U$2.17 46.24,13.22 48.51,15.49 48.51,39.62 47.5,40.64 U$7.P$1 U$7.P$2
TSC_D  (via drill 0.2)
  Top 0.203: v43.43,7.62 43.39,7.66 U$2.12
  Bottom 0.203: v43.43,7.62 34.04,7.62 30.99,10.67 30.99,21.34 23.11,29.21 17.02,29.21 16.23,30 U$11.P$1
TSC_G1_SAMP
  Top 0.203: U$2.10 42.39,5.39 C15.1
TSC_G2_SAMP
  Top 0.203: U$2.14 47.76,11.72 C3.1
TSC_L  (via drill 0.2)
  Top 0.203: v46.23,11.18 44.86,11.18 U$2.13
  Bottom 0.203: v46.23,11.18 46.23,9.4 43.94,7.11 33.78,7.11 30.48,10.41 30.48,21.08 22.86,28.7 8.38,28.7 7.77,29.31 U$10.P$1
TSC_R
  Top 0.203: U$2.15 46.51,12.22 49.53,15.24 49.53,40.13 43.94,45.72 36.58,45.72 35.05,44.2 35.05,38.43 U$9.P$1
TSC_U  (via drill 0.2)
  Top 0.203: v42.93,8.13 42.89,8.16 U$2.11
  Bottom 0.203: v42.93,8.13 42.93,9.14 42.16,9.91 32.51,9.91 31.5,10.92 31.5,21.59 23.11,29.97 23.11,42.93 22.35,43.69 13.03,43.69 U$8.P$1
UART_RX
  Top 0.203: U$2.31 40.39,21.84 RX.TP
UART_TX
  Top 0.203: U$2.30 40.89,21.84 TX.TP

### Text on the board
tDocu: - +
_tsilk: B | A